# Altium schematic sheet CP2102_USB-UART.SchDoc
size B; SheetNumber: 5; SheetTotal: 7
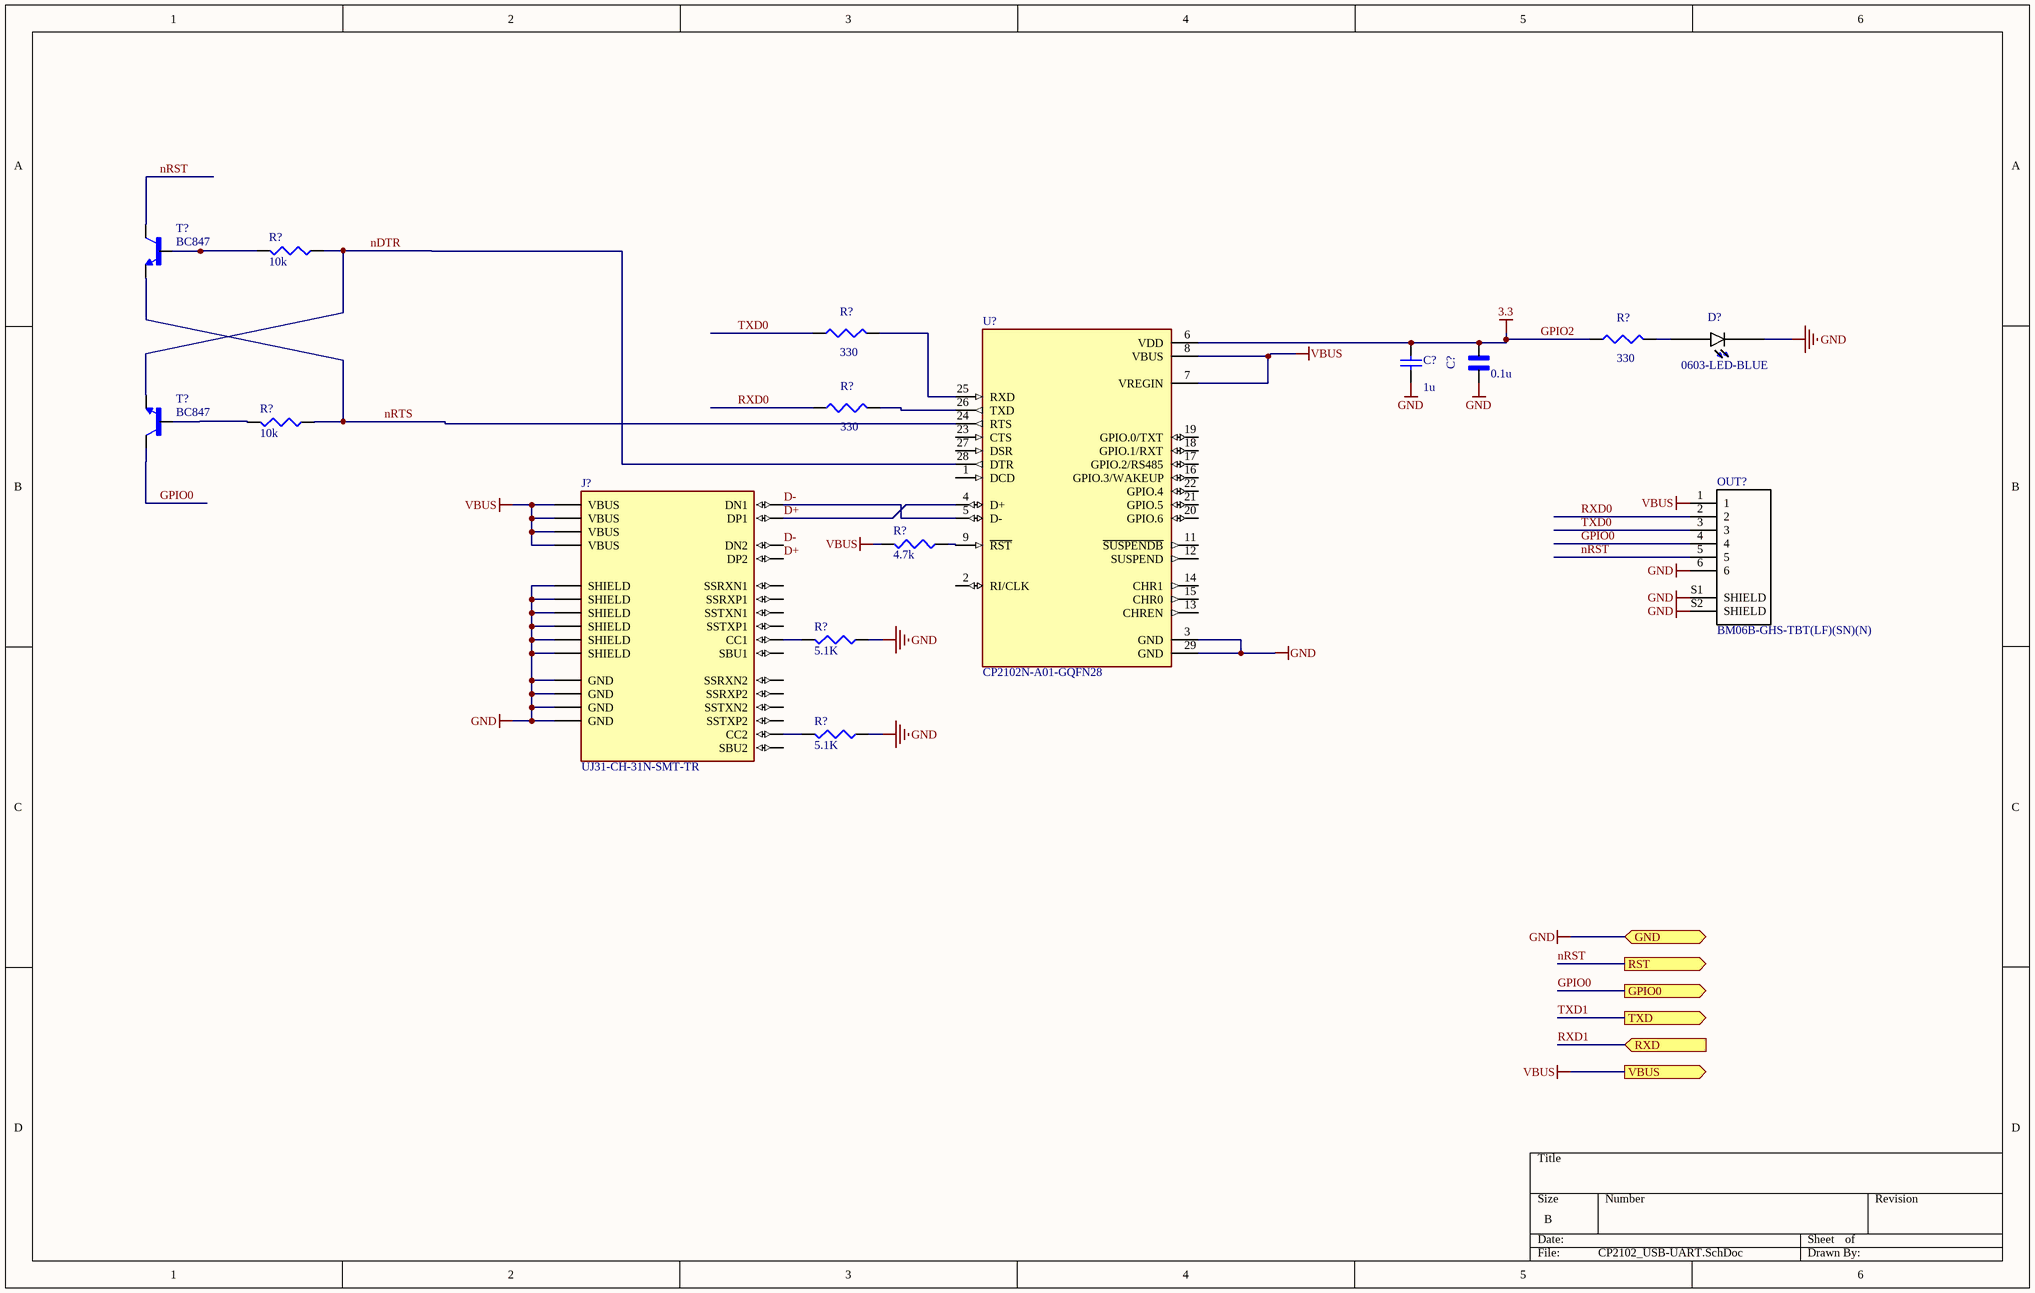
[diagram p0: CP2102_USB-UART.SchDoc]

## Parts
(Parts that share a designator on the sheet are numbered #1, #2 ... from top to bottom, then left to right.)
C?#1  value 1u  [1608[0603]]  (hidden comment: Cap Semi)
C?#2  value 0.1u  [*CAPC1608X90]  (hidden comment: GX035C104MAT2-500)
D?  0603-LED-BLUE  [*LEDM1608X80_LTE-C1906R-14(Primary)]
J?  UJ31-CH-31N-SMT-TR  [CUI_UJ31-CH-31N-SMT-TR]
OUT?  BM06B-GHS-TBT(LF)(SN)(N)  [*JST_BM06B-GHS-TBT(LF)(SN)(N)_BM06B-GHS-TBT(LF)(SN)(N)(Primary)]
R?#1  value 10k  [J1-0603]  (hidden comment: Res3)
R?#2  value 330  [J1-0603]  (hidden comment: Res3)
R?#3  value 330  [J1-0603]  (hidden comment: Res3)
R?#4  value 330  [J1-0603]  (hidden comment: Res3)
R?#5  value 10k  [J1-0603]  (hidden comment: Res3)
R?#6  value 4.7k  [J1-0603]  (hidden comment: Res3)
R?#7  value 5.1K  [J1-0603]  (hidden comment: Res3)
R?#8  value 5.1K  [J1-0603]  (hidden comment: Res3)
T?#1  BC847  [SOT23]
T?#2  BC847  [SOT23]
U?  CP2102N-A01-GQFN28  [QFN50P500X500X80-29N]

## Ports
GND (bidir), GPIO0 (out), RST (out), RXD (in), TXD (out), VBUS (out)

## Nets
GND: C?#1.2 C?#2.2 D?.C J?.A1(GND) J?.A12(GND) J?.B1(GND) J?.B12(GND) J?.SH1(SHIELD) J?.SH2(SHIELD) J?.SH3(SHIELD) J?.SH4(SHIELD) J?.SH5(SHIELD) J?.SH6(SHIELD) OUT?.6 OUT?.S1(SHIELD) OUT?.S2(SHIELD) R?#7.1 R?#8.1 U?.3(GND) U?.29(GND) ; port GND
GPIO2: C?#1.1 C?#2.1 R?#3.1 U?.6(VDD)  [also labelled 3.3]
VBUS: J?.A4(VBUS) J?.A9(VBUS) J?.B4(VBUS) J?.B9(VBUS) OUT?.1 R?#6.2 U?.7(VREGIN) U?.8(VBUS) ; port VBUS
D+: J?.A6(DP1) J?.B6(DP2) U?.4(D+)
D-: J?.A7(DN1) J?.B7(DN2) U?.5(D-)
GPIO0: OUT?.4 T?#2.3(C) ; port GPIO0
nDTR: R?#1.1 T?#2.2(E) U?.28(DTR)
nRST: OUT?.5 T?#1.3(C) ; port RST
nRTS: R?#5.1 T?#1.2(E) U?.24(RTS)
RXD0: OUT?.2 R?#4.1
RXD1: port RXD
TXD0: OUT?.3 R?#2.1
TXD1: port TXD
NetD?_A: D?.A R?#3.2
NetJ?_A5: J?.A5(CC1) R?#7.2
NetJ?_B5: J?.B5(CC2) R?#8.2
NetR?#1_2: R?#1.2 T?#1.1(B)
NetR?#2_2: R?#2.2 U?.25(RXD)
NetR?#4_2: R?#4.2 U?.26(TXD)
NetR?#5_2: R?#5.2 T?#2.1(B)
NetR?#6_1: R?#6.1 U?.9(~{RST})

Not connected (* = marked no-connect by the designer): J? A2(SSTXP1) A3(SSTXN1) A8(SBU1) A10(SSRXN2) A11(SSRXP2) B2(SSTXP2) B3(SSTXN2) B8(SBU2) B10(SSRXN1) B11(SSRXP1); U? 1(DCD) 2(RI/CLK) 11(~{SUSPENDB}) 12(SUSPEND) 13(CHREN) 14(CHR1) 15(CHR0) 16(GPIO.3/WAKEUP) 17(GPIO.2/RS485) 18(GPIO.1/RXT) 19(GPIO.0/TXT) 20(GPIO.6) 21(GPIO.5) 22(GPIO.4) 23(CTS) 27(DSR)

## Library data of the parts
C?#1 = Cap Semi: Capacitor (Semiconductor SIM Model); Published: 8-Jun-2000; LatestRevisionDate: 29-May-2009; LatestRevisionNote: IPC-7351 Footprint Added.; PackageReference: C1206; Publisher: Altium Limited; PackageDescription: Chip Capacitor
C?#2 = GX035C104MAT2-500: Cap Thin Film 0.1uf 50v 0603; MF: AVX; MP: GX035C104MAT2-500 or CL10B104JB8NNNC; Pacage Metric: 1608; Type: SMD; Package: 0603 AVX; SnapEDA_Link: https://www.snapeda.com/parts/GX035C104MAT2-500/AVX/view-part/?ref=snap
D? = LTE-C1906R-14: LED IrLED Chip LED 2-Pin SMD T/R; Package: 0603 Lite-On; MP: 0603-LED-BLUE; SnapEDA_Link: https://www.snapeda.com/parts/LTE-C1906R-14/Lite-On%20Inc./view-part/?ref=snap; Value: *; Type: SMD
J? = UJ31-CH-31N-SMT-TR: Type C, USB 3.1 Gen 2, 5 A, Right Angle, Surface Mount _SMT_, USB Receptacle; MF: CUI Devices; Value: *; SnapEDA_Link: https://www.snapeda.com/parts/UJ31-CH-31N-SMT-TR/CUI%20Devices/view-part/2776725/?ref=snap; Availability: Unavailable; Price: None; Package: None; MP: UJ31-CH-31N-SMT-TR; ChipDip_Link: https://www.chipdip.ru/product1/8002862225; HelpURL: https://www.chipdip.ru/product1/8002862225
OUT? = BM06B-GHS-TBT(LF)(SN)(N): Conn Header Gh Top 6pos 1.25mm; MP: BM06B-GHS-TBT_LF__SN__N_; MF: JST Sales; Package: None; Availability: Unavailable; SnapEDA_Link: https://www.snapeda.com/parts/BM06B-GHS-TBT%28LF%29%28SN%29%28N%29/JST%20Sales%20America%20Inc./view-part/?ref=snap; Price: None; Value: *
R?#1 R?#5 = Res3: Resistor; Pacage Metric: 1608; MP: 10K 1% 0603; ChipDip_Link: https://www.chipdip.ru/product0/9000079736; HelpURL: https://www.chipdip.ru/product0/9000079736; Package: R0603; Type: SMD
R?#2-R?#4 = Res3: Resistor; Pacage Metric: 1608; MP: RC0603FR-07330RL; ChipDip_Link: https://www.chipdip.ru/product0/9000079628; HelpURL: https://www.chipdip.ru/product0/9000079628; Package: R0603; Type: SMD
R?#6-R?#8 = Res3: Resistor; Pacage Metric: 1608; MP: 4.7K 1% 0603; ChipDip_Link: https://www.chipdip.ru/product0/9000079736; HelpURL: https://www.chipdip.ru/product0/9000079736; Package: R0603; Type: SMD
T?#1 T?#2 = BC847: <b>NPN TRANSISTOR</b>; MF: {'manufacturer': u'Rectron'}; Package: None; MP: BC847; Value: *; Availability: Unavailable; Price: None
U? = CP2102N-A01-GQFN28: Ic Bridge Usb To Uart 28qfn; MF: {'manufacturer': u'Silicon Labs'}; MP: CP2102N-A01-GQFN28; Value: *; Package: None; Price: None; Availability: Unavailable